# Altium schematic sheet mcu_with_peripherals.SchDoc
size A4; SheetNumber: 1; SheetTotal: 2; Size: A4; Contact: datasystem.pl
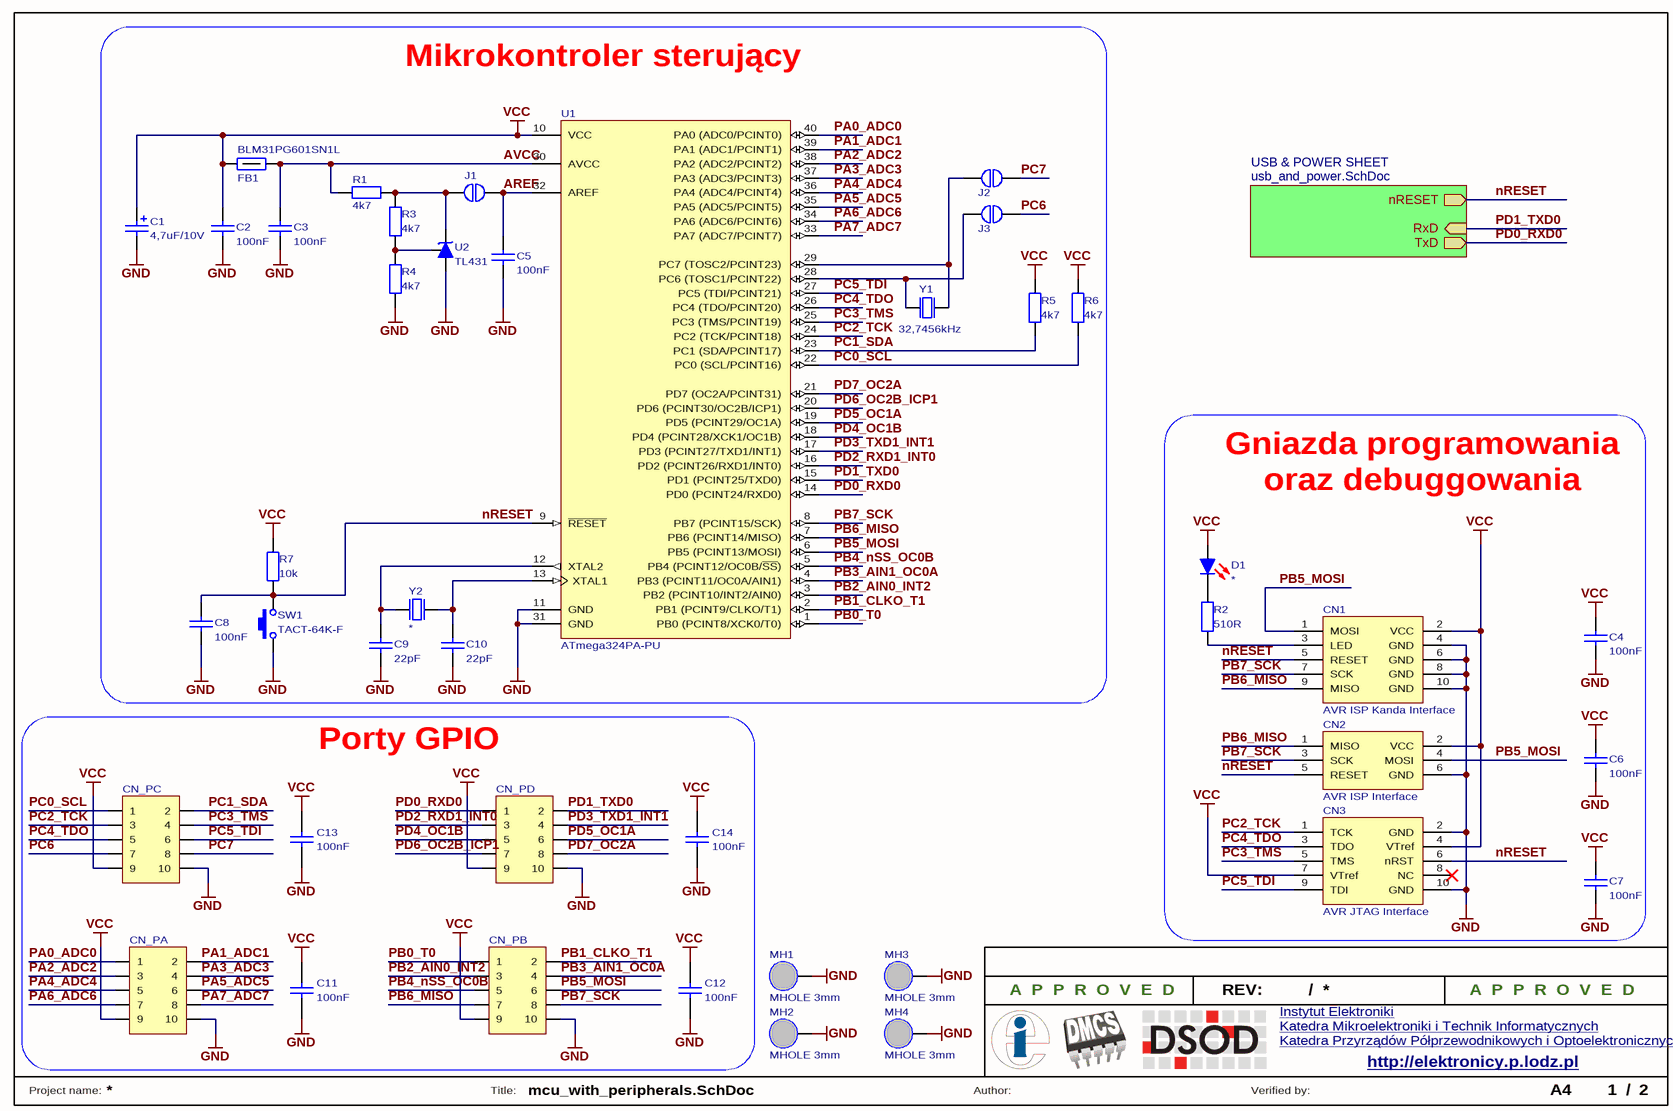
[diagram p0: mcu_with_peripherals.SchDoc]

## Parts
C1  4,7uF/10V  [SMDB]
C2  100nF  [C1206]
C3  100nF  [C1206]
C4  100nF  [C1206]
C5  100nF  [C1206]
C6  100nF  [C1206]
C7  100nF  [C1206]
C8  100nF  [C1206]
C9  22pF  [C1206]
C10  22pF  [C1206]
C11  100nF  [C1206]
C12  100nF  [C1206]
C13  100nF  [C1206]
C14  100nF  [C1206]
CN1  AVR ISP Kanda Interface  [IDC10]
CN2  AVR ISP Interface  [IDC6]
CN3  AVR JTAG Interface  [IDC10]
CN_PA  IDC Connector  [IDC10]  (value not drawn)
CN_PB  IDC Connector  [IDC10]  (value not drawn)
CN_PC  IDC Connector  [IDC10]  (value not drawn)
CN_PD  IDC Connector  [IDC10]  (value not drawn)
D1  *  [LED1206R]
FB1  BLM31PG601SN1L  [FB1206]
J1  *  [JMP2_0603_NO]  (value not drawn)
J2  *  [JMP2_0603_NO]  (value not drawn)
J3  *  [JMP2_0603_NO]  (value not drawn)
MH1  MHOLE 3mm  [3mm screw drill III]  (no BOM)
MH2  MHOLE 3mm  [3mm screw drill III]  (no BOM)
MH3  MHOLE 3mm  [3mm screw drill III]  (no BOM)
MH4  MHOLE 3mm  [3mm screw drill III]  (no BOM)
R1  4k7  [R1206]
R2  510R  [R1206]
R3  4k7  [R1206]
R4  4k7  [R1206]
R5  4k7  [R1206]
R6  4k7  [R1206]
R7  10k  [R1206]
SW1  TACT-64K-F  [TACT-64K-F]
U1  ATmega324PA-PU  [DIP40_PRECISION_W_IC]
U2  TL431  [SOT-23]
Y1  32,7456kHz  [TC38_3x8_H]
Y2  *  [HC49-S]

## Blocks framed on the sheet
Mikrokontroler sterujący: C1-C3 C5 C8-C10 FB1 J1-J3 R1 R3-R7 SW1 U1 U2 Y1 Y2
Porty GPIO: C11-C14 CN_PA CN_PB CN_PC CN_PD

## Sub-sheets
USB & POWER SHEET = usb_and_power.SchDoc: RxD (in), TxD (out), nRESET (out)

## Nets
GND: C1.2 C2.1 C3.1 C4.1 C5.1 C6.1 C7.1 C8.1 C9.1 C10.1 C11.1 C12.1 C13.1 C14.1 CN1.4(GND) CN1.6(GND) CN1.8(GND) CN1.10(GND) CN2.6(GND) CN3.2(GND) CN3.10(GND) CN_PA.10 CN_PB.10 CN_PC.10 CN_PD.10 MH1.1(GND) MH2.1(GND) MH3.1(GND) MH4.1(GND) R4.2 SW1.1 U1.11(GND) U1.31(GND) U2.3(A)
VCC: C1.1 C2.2 C4.2 C6.2 C7.2 C11.2 C12.2 C13.2 C14.2 CN1.2(VCC) CN2.2(VCC) CN3.4(VTref) CN3.7(VTref) CN_PA.9 CN_PB.9 CN_PC.9 CN_PD.9 D1.1(A) FB1.1 R5.2 R6.2 R7.2 U1.10(VCC)
AREF: C5.2 J1.2 U1.32(AREF)
AVCC: C3.2 FB1.2 R1.1 U1.30(AVCC)
nRESET: C8.2 CN1.5(RESET) CN2.5(RESET) CN3.6(nRST) R7.1 SW1.2 U1.9(~{RESET}) ; sheet USB & POWER SHEET/nRESET
PA0_ADC0: CN_PA.1 U1.40(PA0_(ADC0/PCINT0))
PA1_ADC1: CN_PA.2 U1.39(PA1_(ADC1/PCINT1))
PA2_ADC2: CN_PA.3 U1.38(PA2_(ADC2/PCINT2))
PA3_ADC3: CN_PA.4 U1.37(PA3_(ADC3/PCINT3))
PA4_ADC4: CN_PA.5 U1.36(PA4_(ADC4/PCINT4))
PA5_ADC5: CN_PA.6 U1.35(PA5_(ADC5/PCINT5))
PA6_ADC6: CN_PA.7 U1.34(PA6_(ADC6/PCINT6))
PA7_ADC7: CN_PA.8 U1.33(PA7_(ADC7/PCINT7))
PB0_T0: CN_PB.1 U1.1(PB0_(PCINT8/XCK0/T0))
PB1_CLKO_T1: CN_PB.2 U1.2(PB1_(PCINT9/CLKO/T1))
PB2_AIN0_INT2: CN_PB.3 U1.3(PB2_(PCINT10/INT2/AIN0))
PB3_AIN1_OC0A: CN_PB.4 U1.4(PB3_(PCINT11/OC0A/AIN1))
PB4_nSS_OC0B: CN_PB.5 U1.5(PB4_(PCINT12/OC0B/~{SS}))
PB5_MOSI: CN1.1(MOSI) CN2.4(MOSI) CN_PB.6 U1.6(PB5_(PCINT13/MOSI))
PB6_MISO: CN1.9(MISO) CN2.1(MISO) CN_PB.7 U1.7(PB6_(PCINT14/MISO))
PB7_SCK: CN1.7(SCK) CN2.3(SCK) CN_PB.8 U1.8(PB7_(PCINT15/SCK))
PC0_SCL: CN_PC.1 R6.1 U1.22(PC0_(SCL/PCINT16))
PC1_SDA: CN_PC.2 R5.1 U1.23(PC1_(SDA/PCINT17))
PC2_TCK: CN3.1(TCK) CN_PC.3 U1.24(PC2_(TCK/PCINT18))
PC3_TMS: CN3.5(TMS) CN_PC.4 U1.25(PC3_(TMS/PCINT19))
PC4_TDO: CN3.3(TDO) CN_PC.5 U1.26(PC4_(TDO/PCINT20))
PC5_TDI: CN3.9(TDI) CN_PC.6 U1.27(PC5_(TDI/PCINT21))
PC6: CN_PC.7 J3.2
PC7: CN_PC.8 J2.2
PD0_RXD0: CN_PD.1 U1.14(PD0_(PCINT24/RXD0)) ; sheet USB & POWER SHEET/TxD
PD1_TXD0: CN_PD.2 U1.15(PD1_(PCINT25/TXD0)) ; sheet USB & POWER SHEET/RxD
PD2_RXD1_INT0: CN_PD.3 U1.16(PD2_(PCINT26/RXD1/INT0))
PD3_TXD1_INT1: CN_PD.4 U1.17(PD3_(PCINT27/TXD1/INT1))
PD4_OC1B: CN_PD.5 U1.18(PD4_(PCINT28/XCK1/OC1B))
PD5_OC1A: CN_PD.6 U1.19(PD5_(PCINT29/OC1A))
PD6_OC2B_ICP1: CN_PD.7 U1.20(PD6_(PCINT30/OC2B/ICP1))
PD7_OC2A: CN_PD.8 U1.21(PD7_(OC2A/PCINT31))
NetC9_2: C9.2 U1.12(XTAL2) Y2.1(OSC1)
NetC10_2: C10.2 U1.13(XTAL1) Y2.2(OSC2)
NetCN1_3: CN1.3(LED) R2.1
NetD1_2: D1.2(K) R2.2
NetJ1_1: J1.1 R1.2 R3.1 U2.1(K)
NetJ2_1: J2.1 U1.29(PC7_(TOSC2/PCINT23)) Y1.1(OSC1)
NetJ3_1: J3.1 U1.28(PC6_(TOSC1/PCINT22)) Y1.2(OSC2)
NetR3_2: R3.2 R4.1 U2.2(REF)

Not connected (* = marked no-connect by the designer): CN3 8(NC)*

## Notes on the sheet
- Gniazda programowania
- oraz debuggowania
- A  P  P  R  O  V  E  D
- REV:
- /
- Instytut Elektroniki <http://www.eletel.p.lodz.pl/>
- Katedra Mikroelektroniki i Technik Informatycznych <https://www.dmcs.pl/>
- Katedra Przyrządów Półprzewodnikowych i Optoelektronicznych <http://www.dsod.p.lodz.pl/>
- http://elektronicy.p.lodz.pl
- Project name:
- Title:
- Author:
- Verified by:

## Library data of the parts
C1 = Cap Pol Tant: Polarized Tantalum Capacitor; ComponentLink1Description: datasheet; ComponentLink2Description: supplier; Value: 4,7uF/10V
C2-C14 = Cap: Capacitor; ComponentLink1Description: datasheet; ComponentLink2Description: supplier
  C2-C8 C11-C14: Value: 100nF
  C9 C10: Value: 22pF
CN1 = AVR ISP Kanda Interface: Kanda ISP Programming Header for AVR MCU's
CN2 = AVR ISP Interface: ISP Programming Header for AVR MCU's
CN3 = AVR JTAG Interface: JTAG Header for AVR MCU's
CN_PA CN_PB CN_PC CN_PD = CN_5x2
D1 = LED_RED: RED LED; Published: 04-Apr-2006
FB1 = BLM31PG601SN1L: Ferrite Bead; Imp.@ 100MHz:600R; Mounting: SMD; 1,5A; Case: 1206
J1-J3 = JUMPER2_NO: Solder Jumper - Open
MH1-MH4 = MHOLE_3MM: 3mm Mounting Hole
R1 R3-R7 = Res: Resistor; Published: 19-Feb-2006; ComponentLink1Description: datasheet; ComponentLink2Description: supplier
  R1 R3-R6: Value: 4k7
  R7: Value: 10k
R2 = Res: Resistor; Value: 4k7; Published: 19-Feb-2006; ComponentLink1Description: datasheet; ComponentLink2Description: supplier
SW1 = TACT-64K-F: 6x6mm THT Tactile SPST-NO Switch; Published: 30-Jun-2006
U1 = ATmega324PA-PU: 8-bit AVR Microcontroller, 32KB Flash, 1KB EEPROM, 2KB SRAM, 40-pin PDIP, Industrial Grade (-40°C to 85°C); DatasheetVersion: revC, Jun-2011; PackageVersion: revB, Sep-2001; PackageReference: 40P6; PackageDescription: 40-lead (0.600"/15.24mm Wide) Plastic Dual Inline Package (PDIP); Code_JEDEC: MS-011-AC; ComponentLink1Description: Manufacturer URL; ComponentLink1URL: http://www.atmel.com/; ComponentLink2Description: ATmega164A/164PA/324A/324PA/644A/644PA/1284/1284P Datasheet; ComponentLink2URL: http://www.atmel.com/dyn/resources/prod_documents/doc8272.pdf; ComponentLink3Description: ATmega164A/164PA/324A/324PA/644A/644PA/1284/1284P Summary; ComponentLink3URL: http://www.atmel.com/dyn/resources/prod_documents/8272S.pdf
U2 = TL431BCDBZ: 0,5% Precision Programmable Reference
Y1 = Clock XTAL: Crystal Clock Oscillator; ComponentLink1Description: datasheet; ComponentLink2Description: supplier; Value: 32,7456kHz
Y2 = XTAL_2PIN: Crystal Oscillator; ComponentLink1Description: datasheet; ComponentLink2Description: supplier; Value: *